# Altium project Supply Lines.PrjPcb (part 3 of 3)
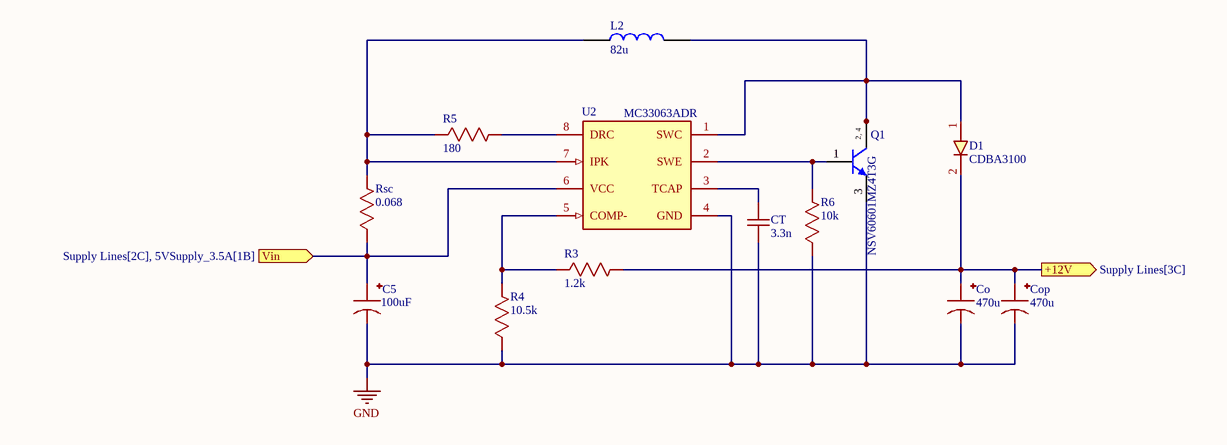
[diagram p4: 12VSupply_1.5A.SchDoc]

## Sheet 12VSupply_1.5A.SchDoc (continued)

### Library data of the parts (continued)
U2 = MC33063ADR: 1.5-A boost, buck, inverting switching regulator, operation from -40°C to 85°C 8-SOIC -40 to 85; Manufacturer: Texas Instruments; Manufacturer Lifecycle Status: ACTIVE; Max Supply Voltage: 40V; Max Output current: 750mA; Min Input Voltage: 3V; Min Output Voltage: 1.25V; Number of Channels: 1; Output Current: 1.5A; Output Type: Adjustable; Quiescent Current: 4mA; Switching Frequency: 100kHz; Synchronous Rectifier: No; Topology: Boost, Buck, Flyback, SEPIC; Supplier: DigiKey; Supplier Part Number: 296-17763-1-ND; Manufacturer Part Number: MC33063ADR; RoHS: Compliant; Category: Voltage Regulators - Switching; Stock: 28348; Pricing: 1=0.7, 10=0.499, 25=0.4484, 100=0.3924, 250=0.36564, 500=0.3495, 1000=0.33623 (USD); Case/Package: SOIC; Contact Plating: Gold; Height: 1.75mm; Lead Free: Lead Free; Length: 4.9mm; Lifecycle Status: Production; Max Operating Temperature: 85°C; Max Output Voltage: 40V; Min Operating Temperature: -40°C; Number of Outputs: 1; Pins: 8; Output Voltage: 1.25V; Packaging: Cut Tape; REACH SVHC: No; Schedule B: 8542390000, 8542390000|8542390000|8542390000|8542390000|8542390000; Termination: SMD/SMT; Thickness: 1.58mm; Weight: 72.603129mg; Width: 3.91mm; ComponentLink1URL: https://octopart.com:443/opatz8j6/c1?t=vRUIAOtUKQQXvKqlrexfz4d8y8SFcyA-_XtbYegMgY-IuIHpQagvyubSixvLCS_JDfIKt_x49E7oZRWRd2BYWVXw9riueRxdDMFAsJXXPSqOaGP_nMLA8edQwSNTnMdmR1QsnAu_2HxxO1rwpalXz5NHB4arOO7zP6RfKxWUVDNQ7aNY3RcHgLh8TPXRHc2v_TLvNv-KiSbEAIFDeTYUuYJBqwNy3sQmWDm06T9xZhirujnXW-71LBNlB35zEcw1f5jl7Jwf5Aatpw8_Y0XlWi65mimBgoqKr7BJn1UODlk-uLR8ncNtZqIX6iRmA18OAad3m3uXmi8PXYahMMydeUxFiCmjmLIy7NAXwyodWvx5H3_ir9o9F0TP9Dp4ezsZFjQt&src-supplier=Texas+Instruments; ComponentLink1Description: https://octopart.com:443/opatz8j6/c1?t=vRUIAOtUKQQXvKqlrexfz4d8y8SFcyA-_XtbYegMgY-IuIHpQagvyubSixvLCS_JDfIKt_x49E7oZRWRd2BYWVXw9riueRxdDMFAsJXXPSqOaGP_nMLA8edQwSNTnMdmR1QsnAu_2HxxO1rwpalXz5NHB4arOO7zP6RfKxWUVDNQ7aNY3RcHgLh8TPXRHc2v_TLvNv-KiSbEAIFDeTYUuYJBqwNy3sQmWDm06T9xZhirujnXW-71LBNlB35zEcw1f5jl7Jwf5Aatpw8_Y0XlWi65mimBgoqKr7BJn1UODlk-uLR8ncNtZqIX6iRmA18OAad3m3uXmi8PXYahMMydeUxFiCmjmLIy7NAXwyodWvx5H3_ir9o9F0TP9Dp4ezsZFjQt&src-supplier=Texas+Instruments; ComponentLink2URL: https://datasheet.octopart.com:443/MC33063ADR-Texas-Instruments-datasheet-10254267.pdf?src-supplier=Texas+Instruments; ComponentLink2Description: https://datasheet.octopart.com:443/MC33063ADR-Texas-Instruments-datasheet-10254267.pdf?src-supplier=Texas+Instruments; ComponentLink3URL: https://sigma.octopart.com:443/49249642/technical_drawing/Texas-Instruments-MC33063ADR.pdf?src-supplier=Texas+Instruments; ComponentLink3Description: https://sigma.octopart.com:443/49249642/technical_drawing/Texas-Instruments-MC33063ADR.pdf?src-supplier=Texas+Instruments; ComponentLink4URL: https://datasheet.octopart.com:443/MC33063ADR-Texas-Instruments-datasheet-149239.pdf?src-supplier=Texas+Instruments; ComponentLink4Description: https://datasheet.octopart.com:443/MC33063ADR-Texas-Instruments-datasheet-149239.pdf?src-supplier=Texas+Instruments; ComponentLink5URL: https://datasheet.octopart.com:443/MC33063ADR-Texas-Instruments-datasheet-149238.pdf?src-supplier=Texas+Instruments; ComponentLink5Description: https://datasheet.octopart.com:443/MC33063ADR-Texas-Instruments-datasheet-149238.pdf?src-supplier=Texas+Instruments; ComponentLink6URL: https://datasheet.octopart.com:443/MC33063ADR-Texas-Instruments-datasheet-149237.pdf?src-supplier=Texas+Instruments; ComponentLink6Description: https://datasheet.octopart.com:443/MC33063ADR-Texas-Instruments-datasheet-149237.pdf?src-supplier=Texas+Instruments; ComponentLink7URL: https://datasheet.octopart.com:443/MC33063ADR-Texas-Instruments-datasheet-149241.pdf?src-supplier=Texas+Instruments; ComponentLink7Description: https://datasheet.octopart.com:443/MC33063ADR-Texas-Instruments-datasheet-149241.pdf?src-supplier=Texas+Instruments; ComponentLink8URL: https://datasheet.octopart.com:443/MC33063ADR-Texas-Instruments-datasheet-149240.pdf?src-supplier=Texas+Instruments; ComponentLink8Description: https://datasheet.octopart.com:443/MC33063ADR-Texas-Instruments-datasheet-149240.pdf?src-supplier=Texas+Instruments; ComponentLink9URL: https://datasheet.octopart.com:443/MC33063ADR-Texas-Instruments-datasheet-81639027.pdf?src-supplier=Farnell; ComponentLink9Description: https://datasheet.octopart.com:443/MC33063ADR-Texas-Instruments-datasheet-81639027.pdf?src-supplier=Farnell; ComponentLink10URL: https://datasheet.octopart.com:443/MC33063ADR-Texas-Instruments-datasheet-37140769.pdf?src-supplier=Farnell; ComponentLink10Description: https://datasheet.octopart.com:443/MC33063ADR-Texas-Instruments-datasheet-37140769.pdf?src-supplier=Farnell; ComponentLink11URL: https://datasheet.octopart.com:443/MC33063ADR-Texas-Instruments-datasheet-12606816.pdf?src-supplier=Farnell; ComponentLink11Description: https://datasheet.octopart.com:443/MC33063ADR-Texas-Instruments-datasheet-12606816.pdf?src-supplier=Farnell; ComponentLink12URL: https://datasheet.octopart.com:443/MC33063ADR-Texas-Instruments-datasheet-33038661.pdf?src-supplier=element14+APAC; ComponentLink12Description: https://datasheet.octopart.com:443/MC33063ADR-Texas-Instruments-datasheet-33038661.pdf?src-supplier=element14+APAC; ComponentLink13URL: https://datasheet.octopart.com:443/MC33063ADR.-Texas-Instruments-datasheet-65572232.pdf?src-supplier=element14+APAC; ComponentLink13Description: https://datasheet.octopart.com:443/MC33063ADR.-Texas-Instruments-datasheet-65572232.pdf?src-supplier=element14+APAC; ComponentLink14URL: https://datasheet.octopart.com:443/MC33063ADR.-Texas-Instruments-datasheet-58444985.pdf?src-supplier=element14+APAC; ComponentLink14Description: https://datasheet.octopart.com:443/MC33063ADR.-Texas-Instruments-datasheet-58444985.pdf?src-supplier=element14+APAC; ComponentLink15URL: https://datasheet.octopart.com:443/MC33063ADR-Texas-Instruments-datasheet-23714746.pdf?src-supplier=Newark; ComponentLink15Description: https://datasheet.octopart.com:443/MC33063ADR-Texas-Instruments-datasheet-23714746.pdf?src-supplier=Newark; ComponentLink16URL: https://datasheet.octopart.com:443/MC33063ADR-Texas-Instruments-datasheet-12052.pdf?src-supplier=Newark; ComponentLink16Description: https://datasheet.octopart.com:443/MC33063ADR-Texas-Instruments-datasheet-12052.pdf?src-supplier=Newark; ComponentLink17URL: https://datasheet.octopart.com:443/MC33063ADR-Texas-Instruments-datasheet-159115500.pdf?src-supplier=LCSC; ComponentLink17Description: https://datasheet.octopart.com:443/MC33063ADR-Texas-Instruments-datasheet-159115500.pdf?src-supplier=LCSC; ComponentLink18URL: https://datasheet.octopart.com:443/MC33063ADR-Texas-Instruments-datasheet-137316104.pdf?src-supplier=Future+Electronics; ComponentLink18Description: https://datasheet.octopart.com:443/MC33063ADR-Texas-Instruments-datasheet-137316104.pdf?src-supplier=Future+Electronics; ComponentLink19URL: https://datasheet.octopart.com:443/MC33063ADR-Texas-Instruments-datasheet-11768196.pdf?src-supplier=Arrow+Electronics; ComponentLink19Description: https://datasheet.octopart.com:443/MC33063ADR-Texas-Instruments-datasheet-11768196.pdf?src-supplier=Arrow+Electronics; ComponentLink20URL: https://datasheet.octopart.com:443/MC33063ADR-Texas-Instruments-datasheet-8883959.pdf?src-supplier=element14; ComponentLink20Description: https://datasheet.octopart.com:443/MC33063ADR-Texas-Instruments-datasheet-8883959.pdf?src-supplier=element14; ComponentLink21URL: https://datasheet.octopart.com:443/MC33063ADR-Texas-Instruments-datasheet-137654.pdf?src-supplier=DigiKey; ComponentLink21Description: https://datasheet.octopart.com:443/MC33063ADR-Texas-Instruments-datasheet-137654.pdf?src-supplier=DigiKey; ComponentLink22URL: https://datasheet.octopart.com:443/MC33063ADR-Texas-Instruments-datasheet-14045796.pdf?src-supplier=iiiC; ComponentLink22Description: https://datasheet.octopart.com:443/MC33063ADR-Texas-Instruments-datasheet-14045796.pdf?src-supplier=iiiC; ComponentLink23URL: http://sigma.octopart.com:80/conflict_mineral_statement/Texas-Instruments-company-63.pdf?src-supplier=Compliance+Statements; ComponentLink23Description: http://sigma.octopart.com:80/conflict_mineral_statement/Texas-Instruments-company-63.pdf?src-supplier=Compliance+Statements; ComponentLink24URL: http://sigma.octopart.com:80/reach_statement/Texas-Instruments-company-64.pdf?src-supplier=Compliance+Statements; ComponentLink24Description: http://sigma.octopart.com:80/reach_statement/Texas-Instruments-company-64.pdf?src-supplier=Compliance+Statements

### Notes on the sheet
- (in symbol NSV60601MZ4T3G) 2, 4

## Nets that join several sheets
GND: Supply Lines (8 pins), 5VSupply_3.5A (11 pins), 12VSupply_1.5A (11 pins)
NetC2_2: Supply Lines (J2.1 J3.1), 5VSupply_3.5A (C2.2 C4.2 L1.2 R1.2)
NetCo_1: Supply Lines (J4.1 J6.1), 12VSupply_1.5A (Co.1 Cop.1 D1.2 R3.2)